# Altium schematic sheet LED_SCH.SchDoc
size A
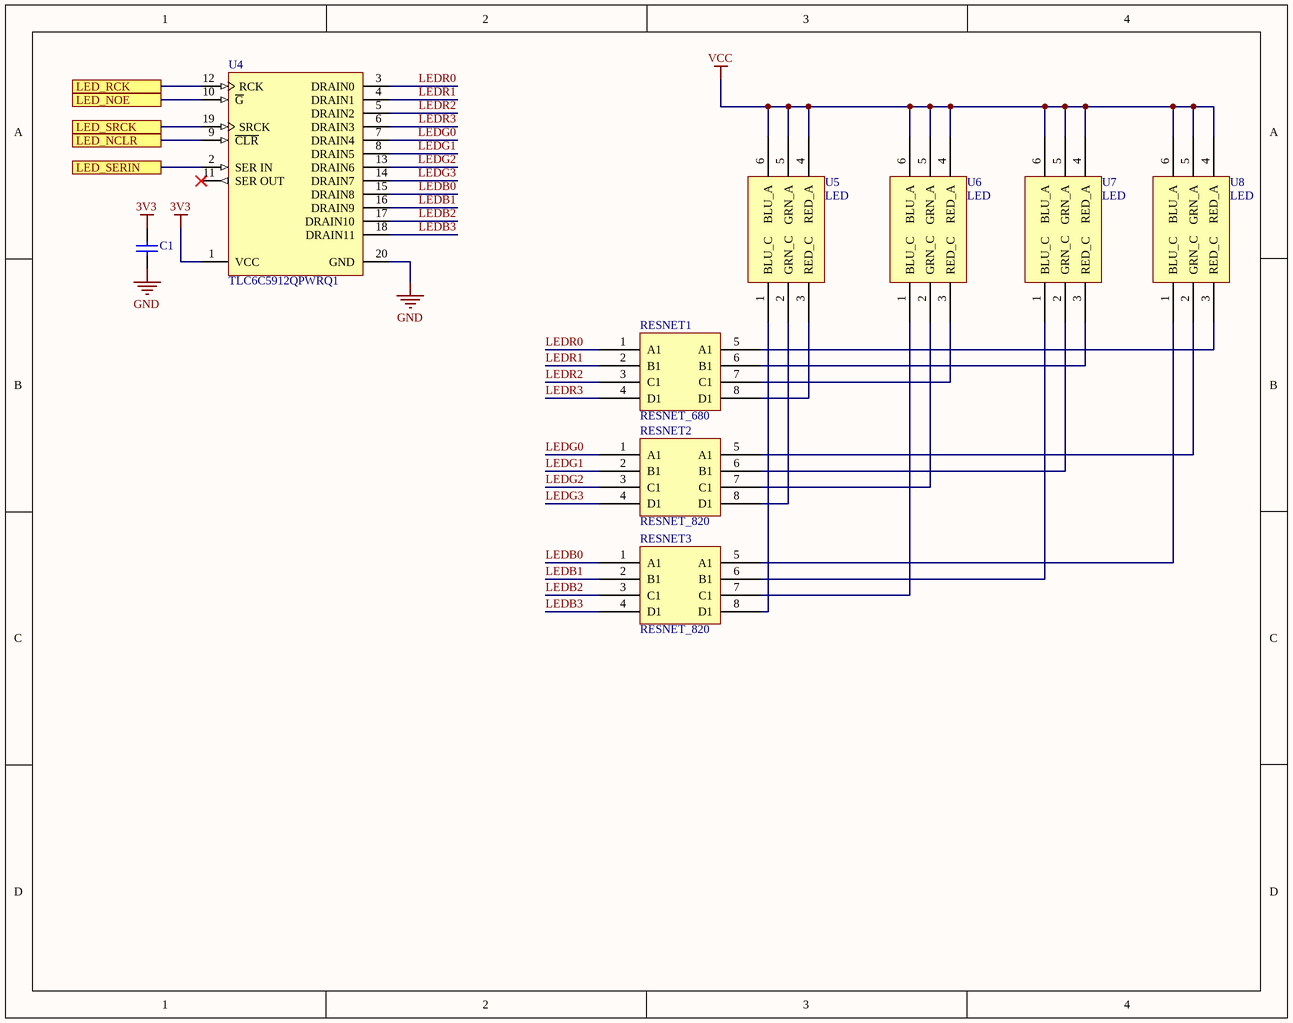
[diagram p0: LED_SCH.SchDoc]

## Parts
C1  08055C104KAJ2A  [CAPC2013X140X50NL20T25]  (value not drawn)
RESNET1  RESNET_680  [CAC-80P320X165-8N]
RESNET2  RESNET_820  [74X_RESNET]
RESNET3  RESNET_820  [74X_RESNET]
U4  TLC6C5912QPWRQ1  [PW0020A_N]
U5  LED  [PLCC6]
U6  LED  [PLCC6]
U7  LED  [PLCC6]
U8  LED  [PLCC6]

## Ports
LED_NCLR, LED_NOE, LED_RCK, LED_SERIN, LED_SRCK

## Nets
3V3: C1.2 U4.1(VCC)
GND: C1.1 U4.20(GND)
VCC: U5.4(RED_A) U5.5(GRN_A) U5.6(BLU_A) U6.4(RED_A) U6.5(GRN_A) U6.6(BLU_A) U7.4(RED_A) U7.5(GRN_A) U7.6(BLU_A) U8.4(RED_A) U8.5(GRN_A) U8.6(BLU_A)
LED_NCLR: U4.9(~{CLR}) ; port LED_NCLR
LED_NOE: U4.10(~{G}) ; port LED_NOE
LED_RCK: U4.12(RCK) ; port LED_RCK
LED_SERIN: U4.2(SER_IN) ; port LED_SERIN
LED_SRCK: U4.19(SRCK) ; port LED_SRCK
LEDB0: RESNET3.1(A1) U4.15(DRAIN8)
LEDB1: RESNET3.2(B1) U4.16(DRAIN9)
LEDB2: RESNET3.3(C1) U4.17(DRAIN10)
LEDB3: RESNET3.4(D1) U4.18(DRAIN11)
LEDG0: RESNET2.1(A1) U4.7(DRAIN4)
LEDG1: RESNET2.2(B1) U4.8(DRAIN5)
LEDG2: RESNET2.3(C1) U4.13(DRAIN6)
LEDG3: RESNET2.4(D1) U4.14(DRAIN7)
LEDR0: RESNET1.1(A1) U4.3(DRAIN0)
LEDR1: RESNET1.2(B1) U4.4(DRAIN1)
LEDR2: RESNET1.3(C1) U4.5(DRAIN2)
LEDR3: RESNET1.4(D1) U4.6(DRAIN3)
NetRESNET1_5: RESNET1.5(A1) U8.3(RED_C)
NetRESNET1_6: RESNET1.6(B1) U7.3(RED_C)
NetRESNET1_7: RESNET1.7(C1) U6.3(RED_C)
NetRESNET1_8: RESNET1.8(D1) U5.3(RED_C)
NetRESNET2_5: RESNET2.5(A1) U8.2(GRN_C)
NetRESNET2_6: RESNET2.6(B1) U7.2(GRN_C)
NetRESNET2_7: RESNET2.7(C1) U6.2(GRN_C)
NetRESNET2_8: RESNET2.8(D1) U5.2(GRN_C)
NetRESNET3_5: RESNET3.5(A1) U8.1(BLU_C)
NetRESNET3_6: RESNET3.6(B1) U7.1(BLU_C)
NetRESNET3_7: RESNET3.7(C1) U6.1(BLU_C)
NetRESNET3_8: RESNET3.8(D1) U5.1(BLU_C)

Not connected (* = marked no-connect by the designer): U4 11(SER_OUT)*

## Library data of the parts
C1 = CMP-2007-04765-1: Manufacturer: AVX Interconnect / Elco; Part Number: 08055C104KAJ2A
RESNET1 = RESNET_680: RES ARRAY 4 RES 680 OHM 2012; ComponentLink1Description: DigiKey; ComponentLink1URL: https://www.digikey.com/product-detail/en/cts-resistor-products/744C083681JP/744C083681JPCT-ND/
RESNET2 RESNET3 = RESNET_820: RES ARRAY 4 RES 820 OHM 2012; ComponentLink1Description: DigiKey; ComponentLink1URL: https://www.digikey.com/product-detail/en/cts-resistor-products/744C083681JP/744C083681JPCT-ND/
U4 = CMP-1582-00026-1: Automotive Power Logic 12-Bit Shift Register LED Driver, PW0020A, LARGE T&R; Part Number: TLC6C5912-Q1; rDS(on)(Ohms): 7.4; tPLH(ns): 210; IO(CONT)(A): 0.05; ICC(uA): 130; VDS(Max)(V): 40; ComponentLink2URL: http://www.ti.com/lit/ds/symlink/tlc6c5912-q1.pdf; ComponentLink1Description: Manufacturer URL; ComponentLink1URL: http://www.ti.com/; Rating: Automotive; Operating Temperature Range(C): -40 to 125; ComponentLink2Description: Datasheet; PackageReference: PW0020A; PartNumber: TLC6C5912QPWRQ1; DatasheetVersion: SLIS141A